# Altium project safety2020.PrjPCB
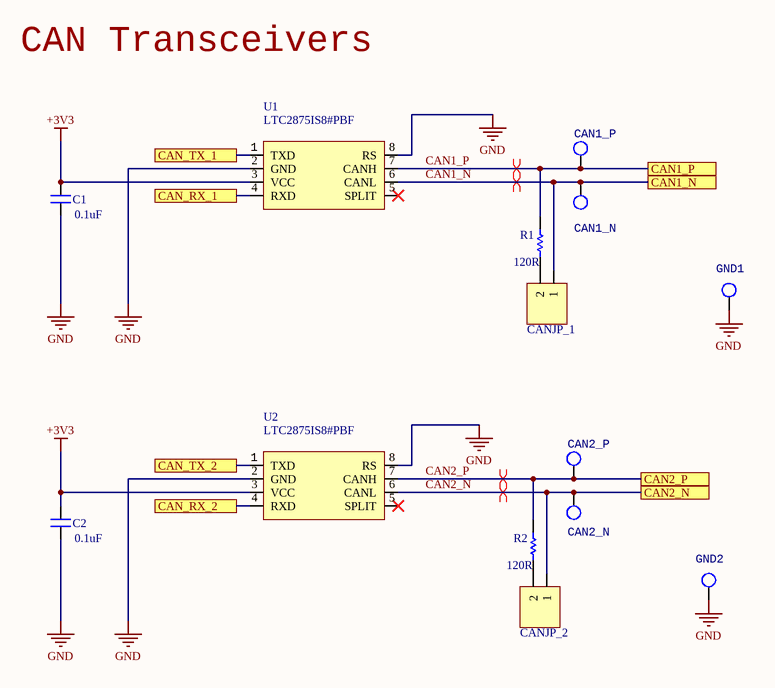
[diagram p0: CAN.SchDoc]
Address1: 200 University Avenue; Address2: Waterloo; Address3: Ontario; Address4: Canada N2L 3G6; BoardName: Your Board Name; DrawnBy: Your Name
7 sheets, 103 parts. Net scope: flat (ports and power ports of the same name join across sheets).
Board file: Safety-Rev1.PcbDoc
Sheets:
  CAN.SchDoc
  Connectors.SchDoc
  MCU.SchDoc
  POWER.SchDoc
  Support.SchDoc
  Sense.SchDoc
  Block Diagram.SchDoc

## Sheet CAN.SchDoc: CAN
size Letter; DrawnBy: Qinyang Bao, Nicole Rosario; Organization: UW Robotics; Address1: 200 University Avenue; Address2: Waterloo; Address3: Ontario; Address4: Canada N2L 3G6

### Parts
C1  value 0.1uF  [CAPC0603(1608)55_N]  (hidden comment: CAP_0.1uF_16V_0603)
C2  value 0.1uF  [CAPC0603(1608)55_N]  (hidden comment: CAP_0.1uF_16V_0603)
CAN1_N  TESTPOINT_LOOP  [TESTPOINT_LOOP]  (value not drawn)
CAN1_P  TESTPOINT_LOOP  [TESTPOINT_LOOP]  (value not drawn)
CAN2_N  TESTPOINT_LOOP  [TESTPOINT_LOOP]  (value not drawn)
CAN2_P  TESTPOINT_LOOP  [TESTPOINT_LOOP]  (value not drawn)
CANJP_1  JUMPER_2  [HDR1X2]  (value not drawn)
CANJP_2  JUMPER_2  [HDR1X2]  (value not drawn)
GND1  TESTPOINT_LOOP  [TESTPOINT_LOOP]  (value not drawn)
GND2  TESTPOINT_LOOP  [TESTPOINT_LOOP]  (value not drawn)
R1  value 120R  [RESC0603(1608)_N]  (hidden comment: RES_120R_0603)
R2  value 120R  [RESC0603(1608)_N]  (hidden comment: RES_120R_0603)
U1  MPN: LTC2875IS8#PBF  [LT-S8_N]  (hidden comment: IC TXRX CAN)
U2  MPN: LTC2875IS8#PBF  [LT-S8_N]  (hidden comment: IC TXRX CAN)

### Ports
CAN1_N, CAN1_P, CAN2_N, CAN2_P, CAN_RX_1, CAN_RX_2, CAN_TX_1, CAN_TX_2

### Nets
+3V3: C1.2 C2.2 U1.3(VCC) U2.3(VCC)
GND: C1.1 C2.1 GND1.1 GND2.1 U1.2(GND) U1.8(RS) U2.2(GND) U2.8(RS)
CAN1_N: CAN1_N.1 CANJP_1.1 U1.6(CANL) ; port CAN1_N
CAN1_P: CAN1_P.1 R1.1 U1.7(CANH) ; port CAN1_P
CAN2_N: CAN2_N.1 CANJP_2.1 U2.6(CANL) ; port CAN2_N
CAN2_P: CAN2_P.1 R2.1 U2.7(CANH) ; port CAN2_P
NetCANJP_1_2: CANJP_1.2 R1.2
NetCANJP_2_2: CANJP_2.2 R2.2
NetSTM1_33: U2.4(RXD) ; port CAN_RX_2
NetSTM1_34: U2.1(TXD) ; port CAN_TX_2
NetSTM1_44: U1.4(RXD) ; port CAN_RX_1
NetSTM1_45: U1.1(TXD) ; port CAN_TX_1

Not connected (* = marked no-connect by the designer): U1 5(SPLIT)*; U2 5(SPLIT)*

### Layout directives
differential pair: CAN1_N, CAN1_P, CAN2_N, CAN2_P

### Notes on the sheet
- CAN Transceivers
- Title
- Size:
- Date:
- Letter
- Drawn By:
- Sheet
- of
- File:

### Library data of the parts
C1 C2 = CAP_0.1uF_16V_0603: CAP CER 0.1UF 16V X7R 0603; MPN: CC0603KRX7R7BB104; Manufacturer: Yageo; Dimensions: 0.063" L x 0.031" W (1.60mm x 0.80mm); Package: 0603 (1608 Metric); Temperature Coefficient: X7R; Voltage Rating: 16V; Supplier Part Number 1: 311-1088-1-ND; Supplier 1: Digi-Key
CAN1_N CAN1_P CAN2_N CAN2_P GND1 GND2 = TESTPOINT_LOOP: Loop testpoint through-hole pad; Manufacturer: Keystone Electronics; Manufacturer Part Number 1: 5002; Supplier Part Number 1: 36-5002-ND; Supplier 1: Digi-Key
CANJP_1 CANJP_2 = JUMPER_2: HEADER 2X1; Supplier 1: Digi-Key; Supplier Part Number 1: A26542-ND
R1 R2 = RES_120R_0603: RES SMD 120 OHM 5% 1/10W 0603; Manufacturer: Yageo; MPN: RC0603JR-07120RL; Package: 0603 (1608 Metric); Dimensions: 0.063" L x 0.031" W (1.60mm x 0.80mm); Tolerance: 5%; Supplier Part Number 1: 311-120GRCT-ND; Supplier 1: Digi-Key
U1 U2 = LTC2875: IC TXRX CAN 4MBPS 8SO; Manufacturer: Linear Technologies; Package: 8-SOIC (0.154", 3.90mm Width); ComponentLink1Description: Datasheet; ComponentLink1URL: https://www.analog.com/media/en/technical-documentation/data-sheets/2875f.pdf; Supplier Part Number 1: LTC2875IS8#PBF-ND; Supplier 1: Digi-Key

## Sheet Connectors.SchDoc: Connectors
size Letter; DrawnBy: Qinyang Bao,  Nicole Rosario; Organization: UW Robotics; Address1: 200 University Avenue; Address2: Waterloo; Address3: Ontario; Address4: Canada N2L 3G6
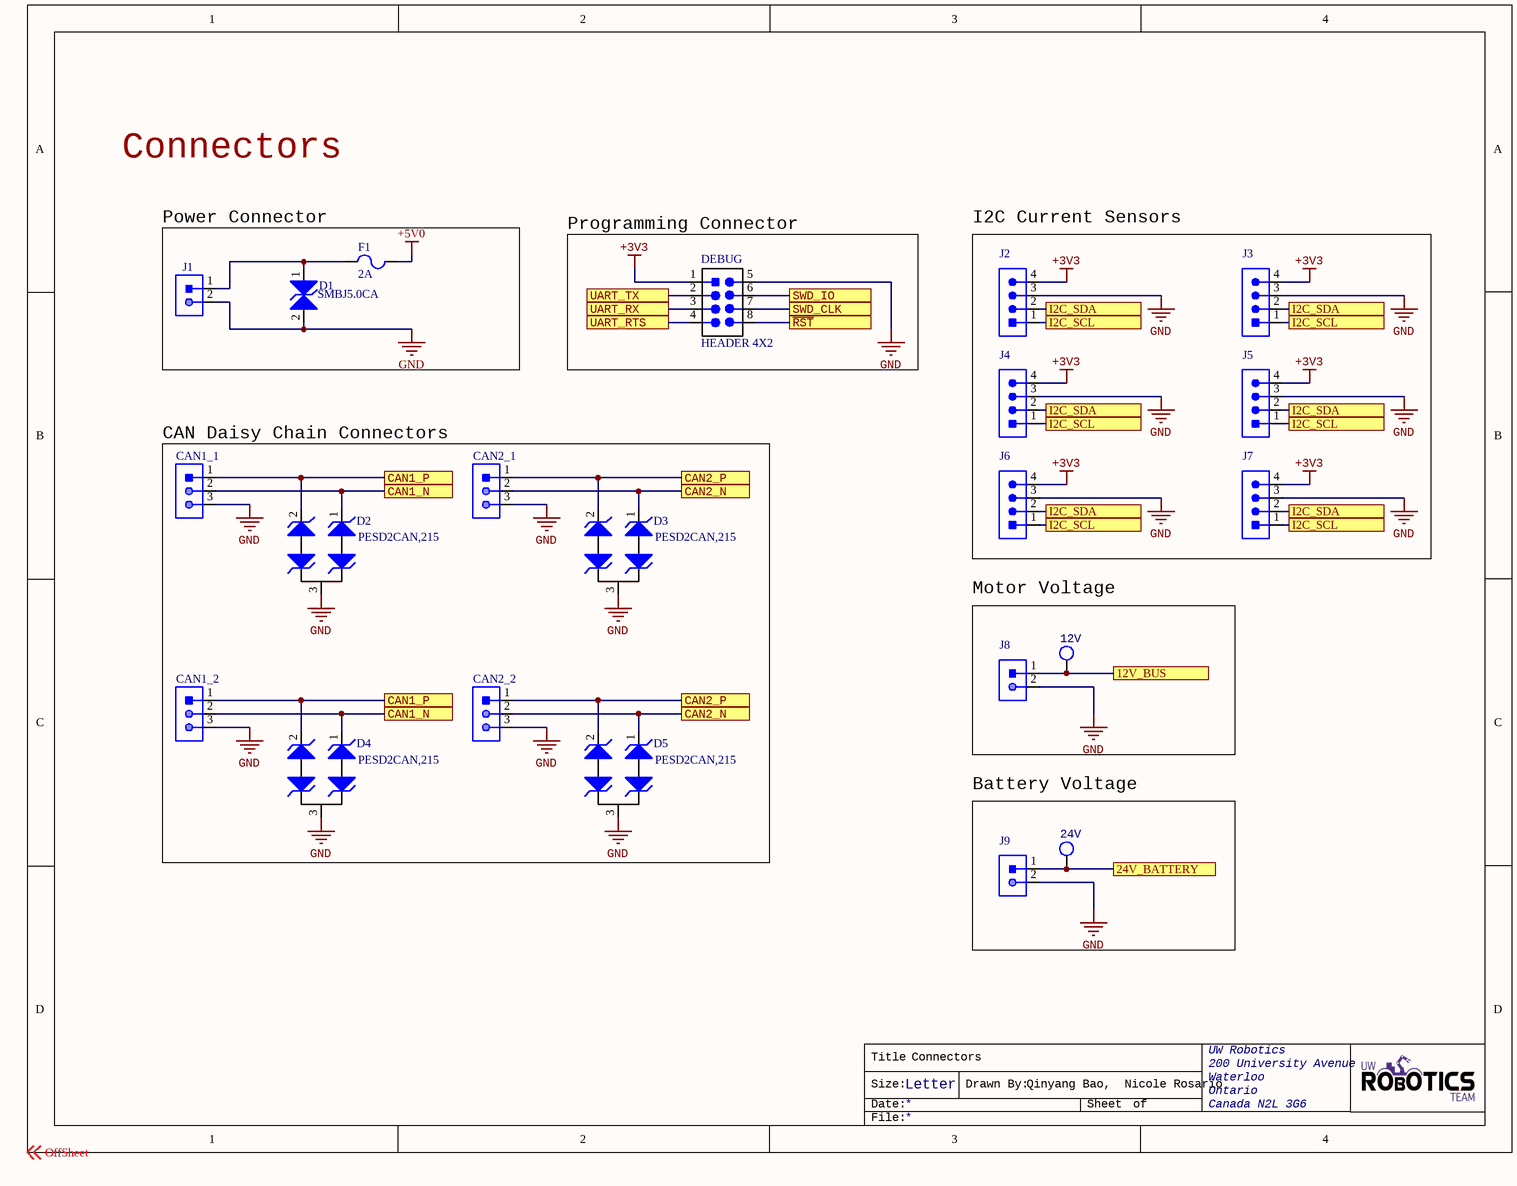
[diagram p1: Connectors.SchDoc]

### Parts
12V  TESTPOINT_LOOP  [TESTPOINT_LOOP]  (value not drawn)
24V  TESTPOINT_LOOP  [TESTPOINT_LOOP]  (value not drawn)
CAN1_1  CON_3M_SM4  [JST-B3B-SM4-TB]  (value not drawn)
CAN1_2  CON_3M_SM4  [JST-B3B-SM4-TB]  (value not drawn)
CAN2_1  CON_3M_SM4  [JST-B3B-SM4-TB]  (value not drawn)
CAN2_2  CON_3M_SM4  [JST-B3B-SM4-TB]  (value not drawn)
D1  Manufacturer Part Number 1: SMBJ5.0CA  [TVS_DIODE_BIDIRECTIONAL]  (hidden comment: TVS_DIODE_BIDIRECTIONAL)
D2  Manufacturer Part Number: PESD2CAN,215  [NXP-SOT323-3]  (hidden comment: TVS_DIODE_CAN)
D3  Manufacturer Part Number: PESD2CAN,215  [NXP-SOT323-3]  (hidden comment: TVS_DIODE_CAN)
D4  Manufacturer Part Number: PESD2CAN,215  [NXP-SOT323-3]  (hidden comment: TVS_DIODE_CAN)
D5  Manufacturer Part Number: PESD2CAN,215  [NXP-SOT323-3]  (hidden comment: TVS_DIODE_CAN)
DEBUG  HEADER 4X2  [HEADER_2X4]
F1  Current Rating: 2A  [FUSE_0603]  (hidden comment: FUSE_2A_0603)
J1  CON_2M_SM4  [JST-B2B-SM4-TB]  (value not drawn)
J2  CON_4M_SM4  [JST-B4B-SM4-TB]  (value not drawn)
J3  CON_4M_SM4  [JST-B4B-SM4-TB]  (value not drawn)
J4  CON_4M_SM4  [JST-B4B-SM4-TB]  (value not drawn)
J5  CON_4M_SM4  [JST-B4B-SM4-TB]  (value not drawn)
J6  CON_4M_SM4  [JST-B4B-SM4-TB]  (value not drawn)
J7  CON_4M_SM4  [JST-B4B-SM4-TB]  (value not drawn)
J8  CON_2M_SM4  [JST-B2B-SM4-TB]  (value not drawn)
J9  CON_2M_SM4  [JST-B2B-SM4-TB]  (value not drawn)

### Blocks framed on the sheet
Power Connector: D1 F1 J1
Programming Connector: DEBUG
I2C Current Sensors: J2-J7
CAN Daisy Chain Connectors: CAN1_1 CAN1_2 CAN2_1 CAN2_2 D2-D5
Motor Voltage: 12V J8
Battery Voltage: 24V J9

### Ports
12V_BUS, 24V_BATTERY, CAN1_N, CAN1_P, CAN2_N, CAN2_P, I2C_SCL, I2C_SDA, SWD_CLK, SWD_IO, UART_RTS, UART_RX, UART_TX, ~{RST}

### Nets
+3V3: DEBUG.1(VCC) J2.4 J3.4 J4.4 J5.4 J6.4 J7.4
+5V0: F1.2
GND: CAN1_1.3 CAN1_2.3 CAN2_1.3 CAN2_2.3 D1.2 D2.3 D3.3 D4.3 D5.3 DEBUG.5(GND) J1.2 J2.3 J3.3 J4.3 J5.3 J6.3 J7.3 J8.2 J9.2
CAN1_N: CAN1_1.2 CAN1_2.2 D2.1 D4.1 ; port CAN1_N
CAN1_P: CAN1_1.1 CAN1_2.1 D2.2 D4.2 ; port CAN1_P
CAN2_N: CAN2_1.2 CAN2_2.2 D3.1 D5.1 ; port CAN2_N
CAN2_P: CAN2_1.1 CAN2_2.1 D3.2 D5.2 ; port CAN2_P
Net12V_1: 12V.1 J8.1 ; port 12V_BUS
Net24V_1: 24V.1 J9.1 ; port 24V_BATTERY
NetC5_2: DEBUG.8 ; port ~{RST}
NetD1_1: D1.1 F1.1 J1.1
NetDEBUG_2: DEBUG.2 ; port UART_TX
NetDEBUG_3: DEBUG.3 ; port UART_RX
NetDEBUG_4: DEBUG.4 ; port UART_RTS
NetDEBUG_6: DEBUG.6 ; port SWD_IO
NetDEBUG_7: DEBUG.7 ; port SWD_CLK
NetJ2_1: J2.1 J3.1 J4.1 J5.1 J6.1 J7.1 ; port I2C_SCL
NetJ2_2: J2.2 J3.2 J4.2 J5.2 J6.2 J7.2 ; port I2C_SDA

### Notes on the sheet
- Connectors
- Labels drawn without touching a wire or pin: OffSheet
- Title
- Size:
- Date:
- Letter
- Drawn By:
- Sheet
- of
- File:

### Library data of the parts
12V 24V = TESTPOINT_LOOP: as CAN1_N on sheet CAN; Supplier Part Number 1: 36-5002-ND; Supplier 1: Digi-Key
CAN1_1 CAN1_2 CAN2_1 CAN2_2 = CON_3M_SM4: Manufacturer: JST; Manufacturer Part Number: B3B-PH-SM4-TB(LF)(SN); Max Current Rating: 2A; Max Voltage Rating: 100V; Pitch: 2mm; Supplier 1: Digi-Key; Supplier Part Number 1: 455-1735-1-ND; ComponentLink1URL: https://datasheet.ciiva.com/11747/0900766b80ddea81-11747684.pdf?src-supplier=RSComponents; ComponentLink1Description: https://datasheet.ciiva.com/11747/0900766b80ddea81-11747684.pdf?src-supplier=RSComponents
D1 = TVS_DIODE_BIDIRECTIONAL: TVS DIODE 5V 9.2V DO214AA; Manufacturer: Nexperia USA Inc.; Manufacturer 1: Littelfuse; Max Surge Current: 65.3A; Reverse Breakdown Voltage: 6.4V; Number of Elements: 1; Peak Pulse Power: 600W; Power Line Protection: No; Max Breakdown Voltage: 7V; Test Current: 10mA; ESD Protection: Yes; Max Reverse Leakage Current: 1.6mA; Max Power Dissipation: 5W; Element Configuration: Single; MPN: SMBJ5.0CA; Package: SC-70, SOT-323; ComponentLink1Description: Datasheet; ComponentLink1URL: https://www.littelfuse.com/~/media/electronics/datasheets/tvs_diodes/littelfuse_tvs_diode_smbj_datasheet.pdf.pdf; Supplier Part Number 1: SMBJ5.0CALFCT-ND; Supplier 1: Digi-Key; Stock 1: 23233; Pricing 1: 1=0.39000, 10=0.31300, 25=0.28640, 100=0.17980, 250=0.17784, 500=0.16650, 1000=0.11322 (USD); Mount: Surface Mount; Case/Package: SMB; Number of Pins: 2; Min Operating Temperature: -65°C; Max Operating Temperature: 150°C; Direction: Bidirectional; Package Quantity: 3000; Packaging: Tape and Reel; Operating Supply Voltage: 5V; Number of Bidirectional Channels: 1; Reverse Standoff Voltage: 5V; Min Breakdown Voltage: 6.4V; Clamping Voltage: 9.2V; Breakdown Voltage: 6.4V; Number of Channels: 1; Polarity: Bidirectional; Termination: SMD/SMT; Power Dissipation: 600W; Peak Pulse Current: 65.3A; Leakage Current: 1.6mA; Voltage Rating (DC): 5V; Composition: Zener; Length: 0.179inch; Height: 0.096inch; Width: 0.155inch; Radiation Hardening: No; REACH SVHC: No SVHC; Lead Free: Lead Free
D2-D5 = TVS_DIODE_CAN: TVS DIODE 24V 41V SOT323-3; Manufacturer: Nexperia USA Inc.; Package: SC-70, SOT-323; ComponentLink1Description: Datasheet; ComponentLink1URL: https://assets.nexperia.com/documents/data-sheet/PESD1CAN-U.pdf; Supplier Part Number 1: 1727-3891-1-ND; Supplier 1: Digi-Key
DEBUG = HEADER 4X2: CONN HEADER VERT 8POS 2.54MM; Manufacturer Part Number 1: M20-9980445; Manufacturer 1: Harwin Inc.; Supplier Part Number 1: 952-2122-ND; Supplier 1: Digi-Key
F1 = FUSE_2A_0603: FUSE SMD 2A 32V; ComponentLink1URL: https://datasheet.ciiva.com/303/467-303400.pdf?src-supplier=Digi-Key; ComponentLink1Description: https://datasheet.ciiva.com/303/467-303400.pdf?src-supplier=Digi-Key; ComponentLink2URL: http://datasheet.octopart.com/0467002.NRHF-Littelfuse-datasheet-32023482.pdf?src-supplier=Future+Electronics; ComponentLink2Description: http://datasheet.octopart.com/0467002.NRHF-Littelfuse-datasheet-32023482.pdf?src-supplier=Future+Electronics; ComponentLink3URL: http://datasheet.octopart.com/0467002.NRHF-Littelfuse-datasheet-136509808.pdf?src-supplier=Future+Electronics; ComponentLink3Description: http://datasheet.octopart.com/0467002.NRHF-Littelfuse-datasheet-136509808.pdf?src-supplier=Future+Electronics; Mount: Surface Mount; Voltage Rating (AC): 32V; Voltage Rating (DC): 32V; Supplier 1: Digi-Key; Supplier Part Number 1: F7132CT-ND; Supplier Packaging 1: Cut Tape
J1 J8 J9 = CON_2M_SM4: Manufacturer: JST; Manufacturer Part Number: B2B-PH-SM4-TB(LF)(SN); Max Current Rating: 2A; Max Voltage Rating: 100V; Pitch: 2mm; Supplier 1: Digi-Key; Supplier Part Number 1: 455-1734-1-ND; ComponentLink1URL: https://datasheet.ciiva.com/11748/0900766b80ddea81-11748001.pdf?src-supplier=RSComponents; ComponentLink1Description: https://datasheet.ciiva.com/11748/0900766b80ddea81-11748001.pdf?src-supplier=RSComponents; ComponentLink2URL: https://datasheet.ciiva.com/16216/b2b-ph-sm4-tblfsn-16216102.pdf?src-supplier=Future+Electronics; ComponentLink2Description: https://datasheet.ciiva.com/16216/b2b-ph-sm4-tblfsn-16216102.pdf?src-supplier=Future+Electronics; ComponentLink3URL: https://datasheet.ciiva.com/8052/80567-8052023.pdf?src-supplier=Element14; ComponentLink3Description: https://datasheet.ciiva.com/8052/80567-8052023.pdf?src-supplier=Element14; ComponentLink4URL: https://datasheet.ciiva.com/712/eph-712504.pdf?src-supplier=Digi-Key; ComponentLink4Description: https://datasheet.ciiva.com/712/eph-712504.pdf?src-supplier=Digi-Key; ComponentLink5URL: https://datasheet.ciiva.com/712/eph-712505.pdf?src-supplier=Digi-Key; ComponentLink5Description: https://datasheet.ciiva.com/712/eph-712505.pdf?src-supplier=Digi-Key; ComponentLink6URL: https://datasheet.ciiva.com/712/eph-712506.pdf?src-supplier=Digi-Key; ComponentLink6Description: https://datasheet.ciiva.com/712/eph-712506.pdf?src-supplier=Digi-Key
J2-J7 = CON_4M_SM4: Manufacturer: JST; Manufacturer Part Number: B4B-PH-SM4-TB(LF)(SN); Max Current Rating: 2A; Max Voltage Rating: 100V; Pitch: 2mm; Supplier 1: Digi-Key; Supplier Part Number 1: 455-1736-1-ND; ComponentLink1URL: https://datasheet.ciiva.com/8052/1699381-8052048.pdf?src-supplier=Element14; ComponentLink1Description: https://datasheet.ciiva.com/8052/1699381-8052048.pdf?src-supplier=Element14; ComponentLink2URL: https://datasheet.ciiva.com/11747/0900766b80ddea81-11747504.pdf?src-supplier=RSComponents; ComponentLink2Description: https://datasheet.ciiva.com/11747/0900766b80ddea81-11747504.pdf?src-supplier=RSComponents; ComponentLink3URL: https://datasheet.ciiva.com/6747/80567-6747409.pdf?src-supplier=Newark; ComponentLink3Description: https://datasheet.ciiva.com/6747/80567-6747409.pdf?src-supplier=Newark; ComponentLink4URL: https://datasheet.ciiva.com/727/eph-727525.pdf?src-supplier=Digi-Key; ComponentLink4Description: https://datasheet.ciiva.com/727/eph-727525.pdf?src-supplier=Digi-Key; ComponentLink5URL: https://datasheet.ciiva.com/712/eph-712582.pdf?src-supplier=Digi-Key; ComponentLink5Description: https://datasheet.ciiva.com/712/eph-712582.pdf?src-supplier=Digi-Key; ComponentLink6URL: https://datasheet.ciiva.com/712/eph-712583.pdf?src-supplier=Digi-Key; ComponentLink6Description: https://datasheet.ciiva.com/712/eph-712583.pdf?src-supplier=Digi-Key

## Sheet MCU.SchDoc: MCU
size Letter; DrawnBy: Qinyang Bao,  Nicole Rosario; Organization: UW Robotics; Address1: 200 University Avenue; Address2: Waterloo; Address3: Ontario; Address4: Canada N2L 3G6
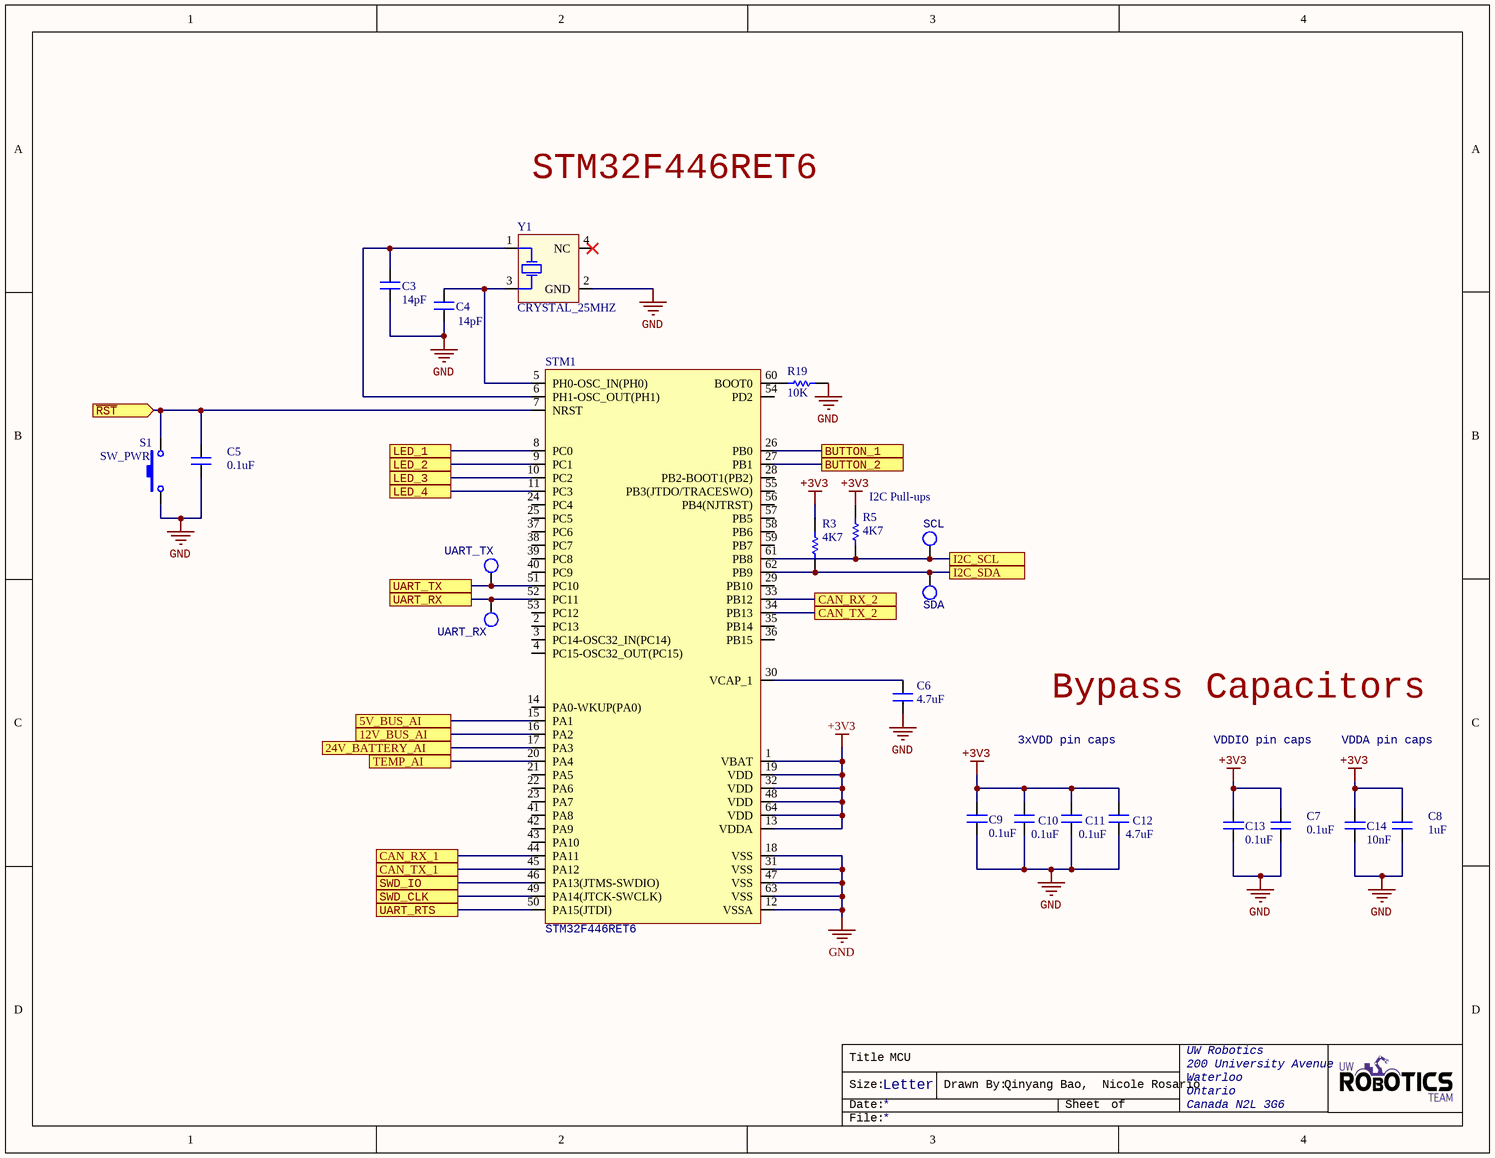
[diagram p2: MCU.SchDoc]

### Parts
C3  value 14pF  [CAPC0603(1608)55_N]  (hidden comment: CL10C140JB8NNNC)
C4  value 14pF  [CAPC0603(1608)55_N]  (hidden comment: CL10C140JB8NNNC)
C5  value 0.1uF  [CAPC0603(1608)55_N]  (hidden comment: CAP_0.1uF_16V_0603)
C6  value 4.7uF  [CAPC0603(1608)55_N]  (hidden comment: CAP_4.7uF_0603)
C7  value 0.1uF  [CAPC0603(1608)55_N]  (hidden comment: CAP_0.1uF_16V_0603)
C8  value 1uF  [CAPC0603(1608)55_N]  (hidden comment: CAP_1uF_16V_0603)
C9  value 0.1uF  [CAPC0603(1608)55_N]  (hidden comment: CAP_0.1uF_16V_0603)
C10  value 0.1uF  [CAPC0603(1608)55_N]  (hidden comment: CAP_0.1uF_16V_0603)
C11  value 0.1uF  [CAPC0603(1608)55_N]  (hidden comment: CAP_0.1uF_16V_0603)
C12  value 4.7uF  [CAPC0603(1608)55_N]  (hidden comment: CAP_4.7uF_0603)
C13  value 0.1uF  [CAPC0603(1608)55_N]  (hidden comment: CAP_0.1uF_16V_0603)
C14  value 10nF  [CAPC0603(1608)55_N]  (hidden comment: CAP_10nF_0603)
R3  value 4K7  [RESC0603(1608)_N]  (hidden comment: RES_4K7_0603)
R5  value 4K7  [RESC0603(1608)_N]  (hidden comment: RES_4K7_0603)
R19  value 10K  [RESC0603(1608)_N]  (hidden comment: RES_10K_0603)
S1  SW_PWR  [PTS830GM140]
SCL  TESTPOINT_LOOP  [TESTPOINT_LOOP]  (value not drawn)
SDA  TESTPOINT_LOOP  [TESTPOINT_LOOP]  (value not drawn)
STM1  STM32F446RET6  [STM-LQFP64_L]
UART_RX  TESTPOINT_LOOP  [TESTPOINT_LOOP]  (value not drawn)
UART_TX  TESTPOINT_LOOP  [TESTPOINT_LOOP]  (value not drawn)
Y1  CRYSTAL_25MHZ  [AVX-CX2520DB32000D0GEJZ1-4_V]

### Ports
5V_BUS_AI, 12V_BUS_AI, 24V_BATTERY_AI, BUTTON_1, BUTTON_2, CAN_RX_1, CAN_RX_2, CAN_TX_1, CAN_TX_2, I2C_SCL, I2C_SDA, LED_1, LED_2, LED_3, LED_4, SWD_CLK, SWD_IO, TEMP_AI, UART_RTS, UART_RX, UART_TX, ~{RST} (in)

### Nets
+3V3: C7.2 C8.2 C9.2 C10.2 C11.2 C12.2 C13.2 C14.2 R3.2 R5.2 STM1.1(VBAT) STM1.13(VDDA) STM1.19(VDD) STM1.32(VDD) STM1.48(VDD) STM1.64(VDD)
GND: C3.1 C4.1 C5.1 C6.1 C7.1 C8.1 C9.1 C10.1 C11.1 C12.1 C13.1 C14.1 R19.1 S1.1 STM1.12(VSSA) STM1.18(VSS) STM1.31(VSS) STM1.47(VSS) STM1.63(VSS) Y1.2(GND)
NetBAT_V_1: STM1.17(PA3) ; port 24V_BATTERY_AI
NetBOARDS_V_1: STM1.15(PA1) ; port 5V_BUS_AI
NetC3_2: C3.2 STM1.6(PH1-OSC_OUT(PH1)) Y1.1(HOT)
NetC4_2: C4.2 STM1.5(PH0-OSC_IN(PH0)) Y1.3(HOT)
NetC5_2: C5.2 S1.2 STM1.7(NRST) ; port ~{RST}
NetC6_2: C6.2 STM1.30(VCAP_1)
NetDEBUG_2: STM1.51(PC10) UART_TX.1 ; port UART_TX
NetDEBUG_3: STM1.52(PC11) UART_RX.1 ; port UART_RX
NetDEBUG_4: STM1.50(PA15(JTDI)) ; port UART_RTS
NetDEBUG_6: STM1.46(PA13(JTMS-SWDIO)) ; port SWD_IO
NetDEBUG_7: STM1.49(PA14(JTCK-SWCLK)) ; port SWD_CLK
NetJ2_1: R5.1 SCL.1 STM1.61(PB8) ; port I2C_SCL
NetJ2_2: R3.1 SDA.1 STM1.62(PB9) ; port I2C_SDA
NetMOTOR_V_1: STM1.16(PA2) ; port 12V_BUS_AI
NetR6_1: STM1.8(PC0) ; port LED_1
NetR7_2: STM1.26(PB0) ; port BUTTON_1
NetR8_1: STM1.9(PC1) ; port LED_2
NetR9_1: STM1.27(PB1) ; port BUTTON_2
NetR10_1: STM1.10(PC2) ; port LED_3
NetR11_1: STM1.11(PC3) ; port LED_4
NetR19_2: R19.2 STM1.60(BOOT0)
NetSTM1_20: STM1.20(PA4) ; port TEMP_AI
NetSTM1_33: STM1.33(PB12) ; port CAN_RX_2
NetSTM1_34: STM1.34(PB13) ; port CAN_TX_2
NetSTM1_44: STM1.44(PA11) ; port CAN_RX_1
NetSTM1_45: STM1.45(PA12) ; port CAN_TX_1

Not connected (* = marked no-connect by the designer): STM1 2(PC13) 3(PC14-OSC32_IN(PC14)) 4(PC15-OSC32_OUT(PC15)) 14(PA0-WKUP(PA0)) 21(PA5) 22(PA6) 23(PA7) 24(PC4) 25(PC5) 28(PB2-BOOT1(PB2)) 29(PB10) 35(PB14) 36(PB15) 37(PC6) 38(PC7) 39(PC8) 40(PC9) 41(PA8) 42(PA9) 43(PA10) 53(PC12) 54(PD2) 55(PB3(JTDO/TRACESWO)) 56(PB4(NJTRST)) 57(PB5) 58(PB6) 59(PB7); Y1 4(NC)*

### Notes on the sheet
- STM32F446RET6
- (near R5) I2C Pull-ups
- Bypass Capacitors
- 3xVDD pin caps
- VDDIO pin caps
- VDDA pin caps
- Title
- Size:
- Date:
- Letter
- Drawn By:
- Sheet
- of
- File:

### Library data of the parts
C3 C4 = CL10C140JB8NNNC: Cap Ceramic 14pF 50V C0G 5% SMD 0603 125C Cardboard T/R; Manufacturer 1: Samsung; Voltage Rating: 50V; Supplier Part Number 1: 1276-2187-1-ND; Supplier 1: Digi-Key; Manufacturer Part Number 1: CL10C140JB8NNNC; Stock 1: 187088; Pricing 1: 1=0.10000, 10=0.06700, 100=0.02980, 500=0.02130, 1000=0.01673 (USD); RoHS: Yes; Mount: Surface Mount; Case/Package: 0603; Case Code (Metric): 1608; Case Code (Imperial): 0603; Min Operating Temperature: -55°C; Max Operating Temperature: 125°C; Tolerance: 5%; Package Quantity: 1; Packaging: Tape and Reel; Voltage Rating (DC): 50V; Dielectric: C0G; Length: 1.6mm; Height: 0.8mm; Width: 0.031inch; Depth: 0.8mm; Thickness: 0.035inch; Radiation Hardening: No; ComponentLink1URL: https://datasheet.ciiva.com/25782/cl10c140jb8nnnc-25782947.pdf?src-supplier=Digi-Key; ComponentLink1Description: https://datasheet.ciiva.com/25782/cl10c140jb8nnnc-25782947.pdf?src-supplier=Digi-Key; Capacitance: 14pF
C5 C7 C9-C11 C13 = CAP_0.1uF_16V_0603: CAP CER 0.1UF 16V X7R 0603; Manufacturer: Yageo; MPN: CC0603KRX7R7BB104; Dimensions: 0.063" L x 0.031" W (1.60mm x 0.80mm); Package: 0603 (1608 Metric); Temperature Coefficient: X7R; Voltage Rating: 16V; Supplier Part Number 1: 311-1088-1-ND; Supplier 1: Digi-Key
C6 C12 = CAP_4.7uF_0603: CAP CER 4.7UF 6.3V X5R 0603; Manufacturer: Yageo; MPN: CC0603KRX5R5BB475; Dimensions: 0.063" L x 0.031" W (1.60mm x 0.80mm); Package: 0603 (1608 Metric); Temperature Coefficient: X5R; Voltage Rating: 6.3V; Supplier Part Number 1: 311-1521-1-ND; Supplier 1: Digi-Key
C8 = CAP_1uF_16V_0603: CAP CER 1UF 16V Y5V 0603; Manufacturer: Yageo; MPN: CC0603ZRY5V7BB105; Dimensions: 0.063" L x 0.031" W (1.60mm x 0.80mm); Package: 0603 (1608 Metric); Temperature Coefficient: Y5V; Voltage Rating: 16V; Supplier Part Number 1: 311-1372-1-ND; Supplier 1: Digi-Key
C14 = CAP_10nF_0603: CAP CER 10000PF 16V X7R 0603; Manufacturer: Yageo; MPN: CC0603KRX7R7BB103; Dimensions: 0.063" L x 0.031" W (1.60mm x 0.80mm); Package: 0603 (1608 Metric); Temperature Coefficient: X7R; Voltage Rating: 16V; Supplier Part Number 1: 311-3369-1-ND; Supplier 1: Digi-Key
R3 R5 = RES_4K7_0603: RES SMD 4.7K OHM 5% 1/10W 0603; Manufacturer: Yageo; MPN: RC0603JR-074K7L; Package: 0603 (1608 Metric); Dimensions: 0.063" L x 0.031" W (1.60mm x 0.80mm); Tolerance: 5%; Supplier Part Number 1: 311-4.7KGRCT-ND; Supplier 1: Digi-Key
R19 = RES_10K_0603: RES SMD 10K OHM 5% 1/10W 0603; Manufacturer: Yageo; MPN: RC0603JR-0710KL; Package: 0603 (1608 Metric); Dimensions: 0.063" L x 0.031" W (1.60mm x 0.80mm); Tolerance: 5%; Supplier Part Number 1: 311-10KGRCT-ND; Supplier 1: Digi-Key
S1 = SW_PWR: Power Switch (Red); pin to pad: 2>4; MPN: PTS830GM140 SMTR LFS; Manufacturer: C&K; ComponentLink1Description: Datasheet; ComponentLink1URL: https://www.ckswitches.com/media/1478/pts830.pdf; Supplier Part Number 1: CKN10587CT-ND; Supplier 1: Digi-Key
SCL SDA UART_RX UART_TX = TESTPOINT_LOOP: as CAN1_N on sheet CAN; Supplier Part Number 1: 36-5002-ND; Supplier 1: Digi-Key
STM1 = MCU_STM32F446RET6: ARM Cortex-M4 32-bit MCU+FPU, 512 KB Flash, 128 KB Internal RAM, 50 I/Os, 64-Pin LQFP, -40 to 85 degC, Tray; I/Os (High Current): 50; Supply Voltage(Vcc) min (V): 1.7; Operating Frequency(F) (Processor speed) (MHz): 180; D/A Converter: 2; Internal RAM Size (kB): 128; FLASH Size (Prog) (kB): 512; Core: ARM Cortex-M4; ComponentLink1Description: Manufacturer URL; Package Reference: 64-Pin Low-profile Quad Flat Package, Body 10 x 10 mm, Pitch 0.5 mm; ComponentLink2URL: http://www.st.com/st-web-ui/static/active/en/resource/technical/document/datasheet/DM00141306.pdf; Packing: Tray; DatasheetVersion: Rev. 6; ComponentLink1URL: http://www.st.com/; ComponentLink2Description: Datasheet; Package Description: LQFP64; Mounting Technology: Surface Mount; Supplier Part Number 1: 497-15376-ND; Supplier 1: Digi-Key
Y1 = CRYSTAL_25MHZ: CRYSTAL 25.0000MHZ 12PF SMD; Manufacturer 1: Kyocera AVX; Manufacturer Part Number 1: CX2520DB25000H0FLJC1; Frequency: 25MHz; ESR (Equivalent Series Resistance): 80R; Frequency Stability: 15ppm; Frequency Tolerance: 10ppm; ComponentLink1Description: https://media.digikey.com/pdf/Data%20Sheets/AVX%20PDFs/CX2520DB_USY1M-H1-16429-00_Spec.pdf?src-supplier=Digi-Key; ComponentLink1URL: https://media.digikey.com/pdf/Data%20Sheets/AVX%20PDFs/CX2520DB_USY1M-H1-16429-00_Spec.pdf?src-supplier=Digi-Key; Supplier 1: Digi-Key; Supplier Part Number 1: 1253-1724-1-ND; Stock 1: 11741; Pricing 1: 1=0.72000, 10=0.63300, 50=0.59120, 100=0.52250, 500=0.49500, 1000=0.41250 (USD); RoHS: Yes; Mount: Surface Mount; Case/Package: SMD/SMT; Min Operating Temperature: -30°C; Max Operating Temperature: 85°C; Packaging: Tape and Reel; Load Capacitance: 12pF; Length: 0.098inch; Height: 0.022inch; Width: 0.079inch; Ratings: AEC-Q200

## Sheet POWER.SchDoc: Power
size Letter; DrawnBy: Qinyang Bao,  Nicole Rosario; Organization: UW Robotics; Address1: 200 University Avenue; Address2: Waterloo; Address3: Ontario; Address4: Canada N2L 3G6
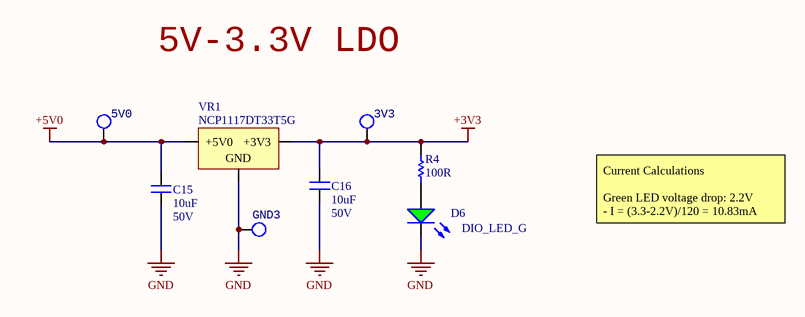
[diagram p3: POWER.SchDoc]

### Parts
3V3  TESTPOINT_LOOP  [TESTPOINT_LOOP]  (value not drawn)
5V0  TESTPOINT_LOOP  [TESTPOINT_LOOP]  (value not drawn)
C15  Voltage Rating: 50V  [CAPC1206(3216)]  (hidden comment: 10uF)
C16  Voltage Rating: 50V  [CAPC1206(3216)]  (hidden comment: 10uF)
D6  DIO_LED_G  [LED_0805_LINE]
GND3  TESTPOINT_LOOP  [TESTPOINT_LOOP]  (value not drawn)
R4  value 100R  [RESC0603(1608)_N]  (hidden comment: RES_100R_0603)
VR1  MPN: NCP1117DT33T5G  [VOLTAGE_REGULATOR]  (hidden comment: 5V0_3V3_LDO)

### Nets
+3V3: 3V3.1 C16.1 R4.2 VR1.2(+3V3)
+5V0: 5V0.1 C15.1 VR1.3(+5V0)
GND: C15.2 C16.2 D6.2(K) GND3.1 VR1.1(GND)
NetD6_1: D6.1(A) R4.1

### Notes on the sheet
- 5V-3.3V LDO
- Current Calculations
  Green LED voltage drop: 2.2V
  - I = (3.3-2.2V)/120 = 10.83mA
- Title
- Size:
- Date:
- Letter
- Drawn By:
- Sheet
- of
- File:

### Library data of the parts
3V3 5V0 GND3 = TESTPOINT_LOOP: as CAN1_N on sheet CAN; Supplier Part Number 1: 36-5002-ND; Supplier 1: Digi-Key
C15 C16 = CAP_10uF_50V_1206: CAP CER 10UF 50V X5R 1206; MPN: GRT31CR61H106KE01L; Manufacturer: Murata; Dimensions: 0.126" L x 0.063" W (3.20mm x 1.6mm); Package: 1206 (3216 Metric); Supplier Part Number 1: 490-12456-1-ND; Supplier 1: Digi-Key; Value: 10uF
D6 = DIO_LED_G: LED GREEN DIFFUSED 0805 SMD; MPN: LG R971-KN-1; Manufacturer: OSRAM; Forward Voltage Drop: 2.2V; Package: 0805 (2012 Metric); Supplier Part Number 1: 475-1410-1-ND; Supplier 1: Digi-Key
R4 = RES_100R_0603: RES SMD 100 OHM 1% 1/10W 0603; Manufacturer: Yageo; MPN: RC0603FR-07100RL; Package: 0603 (1608 Metric); Dimensions: 0.063" L x 0.031" W (1.60mm x 0.80mm); Tolerance: 1%; Supplier Part Number 1: 311-100HRCT-ND; Supplier 1: Digi-Key
VR1 = 5V0_3V3_LDO: IC REG LINEAR 3.3V 1A DPAK; Manufacturer: ON Semiconductor; Current Output: 1A; Supplier Part Number 1: NCP1117DT33T5GOSCT-ND; Supplier 1: Digi-Key

## Sheet Support.SchDoc: Support
size Letter; DrawnBy: Qinyang Bao, Nicole Rosario; Organization: UW Robotics; Address1: 200 University Avenue; Address2: Waterloo; Address3: Ontario; Address4: Canada N2L 3G6
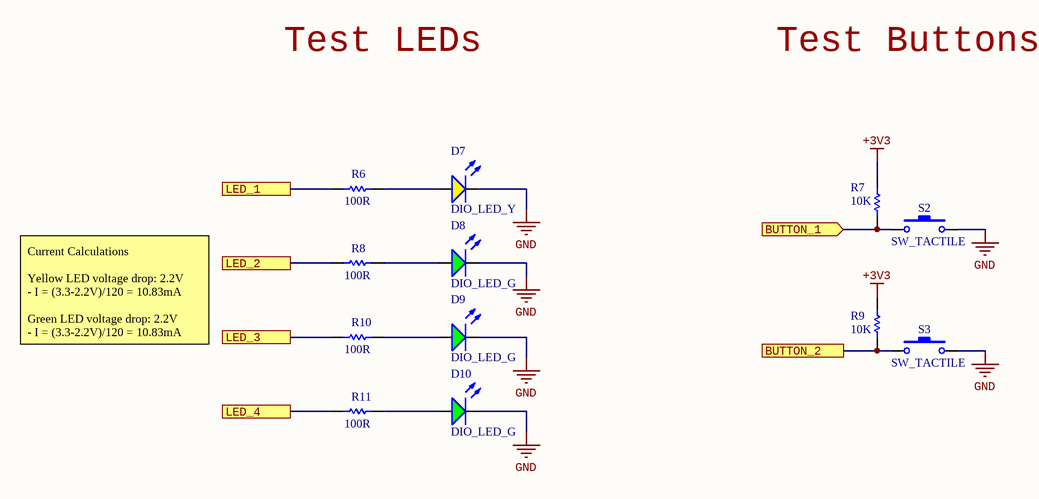
[diagram p4: Support.SchDoc]

### Parts
D7  DIO_LED_Y  [LED_0805_LINE]
D8  DIO_LED_G  [LED_0805_LINE]
D9  DIO_LED_G  [LED_0805_LINE]
D10  DIO_LED_G  [LED_0805_LINE]
R6  value 100R  [RESC0603(1608)_N]  (hidden comment: RES_100R_0603)
R7  value 10K  [RESC0603(1608)_N]  (hidden comment: RES_10K_0603)
R8  value 100R  [RESC0603(1608)_N]  (hidden comment: RES_100R_0603)
R9  value 10K  [RESC0603(1608)_N]  (hidden comment: RES_10K_0603)
R10  value 100R  [RESC0603(1608)_N]  (hidden comment: RES_100R_0603)
R11  value 100R  [RESC0603(1608)_N]  (hidden comment: RES_100R_0603)
S2  SW_TACTILE  [B3U-1100P]
S3  SW_TACTILE  [B3U-1100P]

### Ports
BUTTON_1 (in), BUTTON_2, LED_1, LED_2, LED_3, LED_4

### Nets
+3V3: R7.1 R9.2
GND: D7.2(K) D8.2(K) D9.2(K) D10.2(K) S2.2 S3.2
NetD7_1: D7.1(A) R6.2
NetD8_1: D8.1(A) R8.2
NetD9_1: D9.1(A) R10.2
NetD10_1: D10.1(A) R11.2
NetR6_1: R6.1 ; port LED_1
NetR7_2: R7.2 S2.1 ; port BUTTON_1
NetR8_1: R8.1 ; port LED_2
NetR9_1: R9.1 S3.1 ; port BUTTON_2
NetR10_1: R10.1 ; port LED_3
NetR11_1: R11.1 ; port LED_4

### Notes on the sheet
- Test LEDs
- Test Buttons
- Current Calculations
  Yellow LED voltage drop: 2.2V
  - I = (3.3-2.2V)/120 = 10.83mA
  Green LED voltage drop: 2.2V
  - I = (3.3-2.2V)/120 = 10.83mA
- Title
- Size:
- Date:
- Letter
- Drawn By:
- Sheet
- of
- File:

### Library data of the parts
D7 = DIO_LED_Y: LED YELLOW DIFFUSED 0805 SMD; Manufacturer: OSRAM; MPN: LY R976-PS-36; Forward Voltage Drop: 2.2V; Package: 0805 (2012 Metric); Supplier Part Number 1: 475-2560-1-ND; Supplier 1: Digi-Key
D8-D10 = DIO_LED_G: LED GREEN DIFFUSED 0805 SMD; Manufacturer: OSRAM; MPN: LG R971-KN-1; Forward Voltage Drop: 2.2V; Package: 0805 (2012 Metric); Supplier Part Number 1: 475-1410-1-ND; Supplier 1: Digi-Key
R6 R8 R10 R11 = RES_100R_0603: as R4 on sheet POWER; Package: 0603 (1608 Metric); Dimensions: 0.063" L x 0.031" W (1.60mm x 0.80mm); Tolerance: 1%; Supplier Part Number 1: 311-100HRCT-ND; Supplier 1: Digi-Key
R7 R9 = RES_10K_0603: as R19 on sheet MCU; Package: 0603 (1608 Metric); Dimensions: 0.063" L x 0.031" W (1.60mm x 0.80mm); Tolerance: 5%; Supplier Part Number 1: 311-10KGRCT-ND; Supplier 1: Digi-Key
S2 S3 = SW_TACTILE: Tactile Switch (Grey); Manufacturer: Omron Electronics Inc-EMC Div; MPN: B3U-1100P; Supplier 1: Digi-Key; Supplier Part Number 1: SW1021CT-ND

## Sheet Sense.SchDoc: Sense
size Letter; DrawnBy: Qinyang Bao, Kyle Hong; Organization: UW Robotics; Address1: 200 University Avenue; Address2: Waterloo; Address3: Ontario; Address4: Canada N2L 3G6
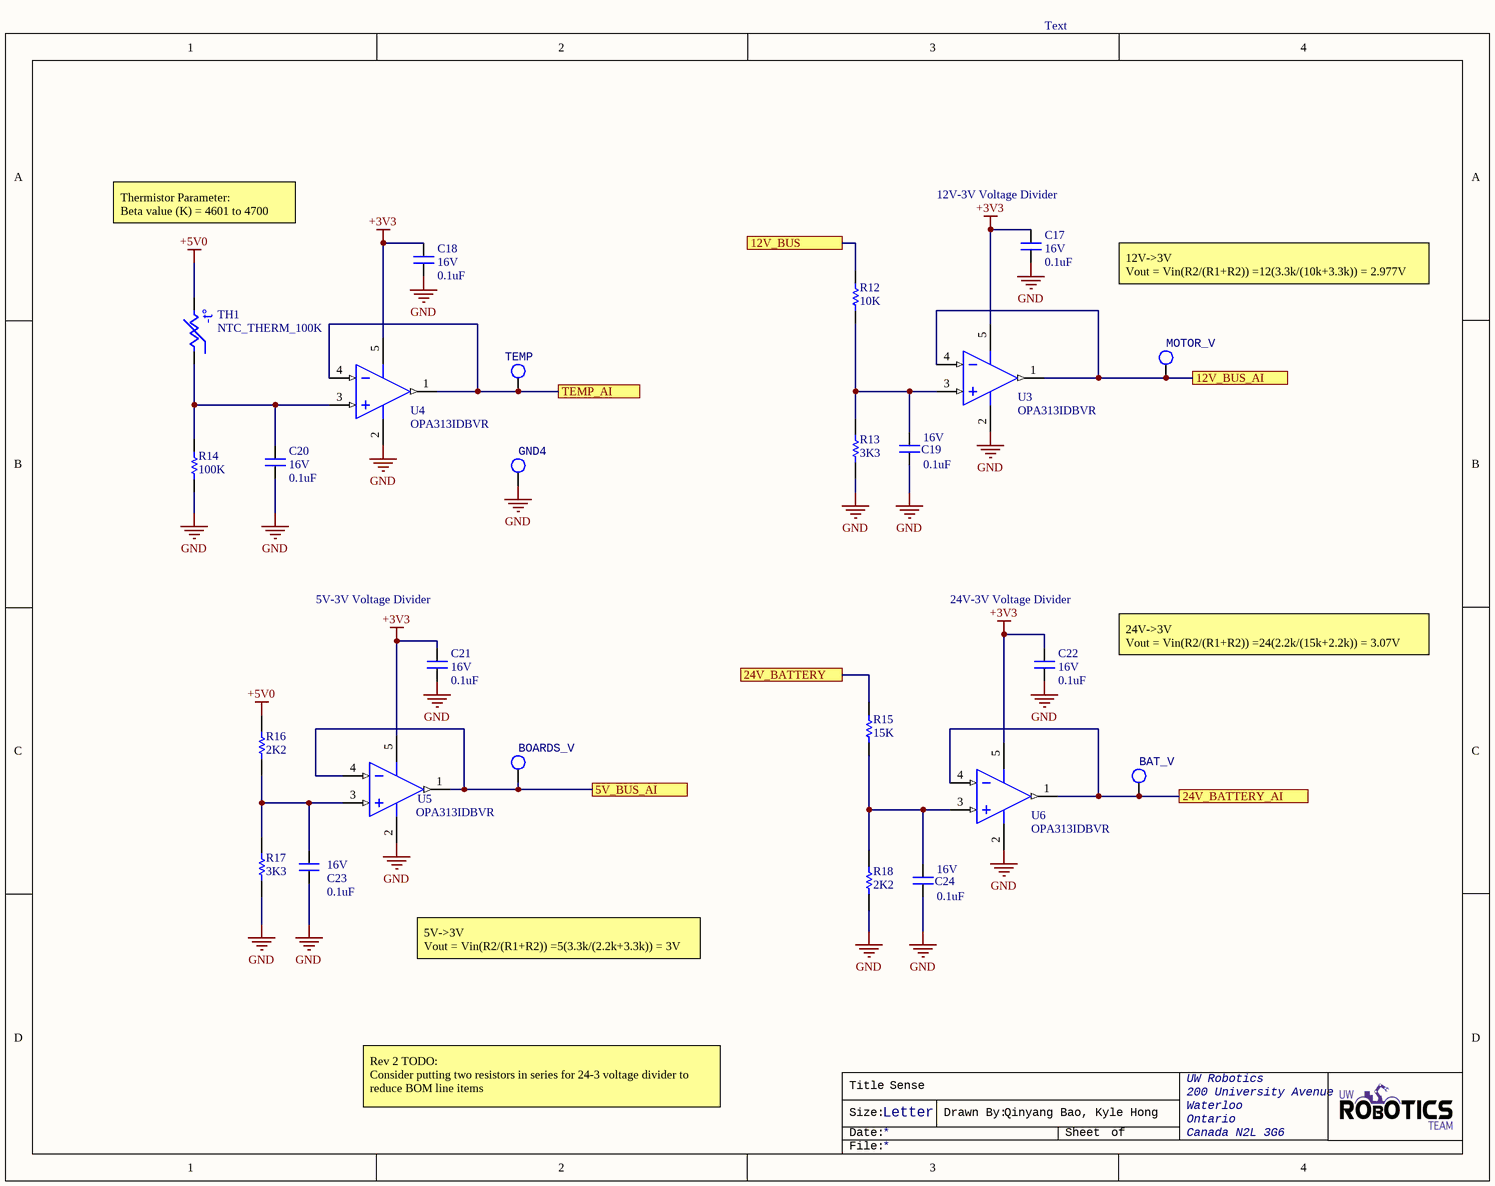
[diagram p5: Sense.SchDoc]

### Parts
BAT_V  TESTPOINT_LOOP  [TESTPOINT_LOOP]  (value not drawn)
BOARDS_V  TESTPOINT_LOOP  [TESTPOINT_LOOP]  (value not drawn)
C17  value 0.1uF  Voltage Rating: 16V  [CAPC0603(1608)55_N]  (hidden comment: CAP_0.1uF_16V_0603)
C18  value 0.1uF  Voltage Rating: 16V  [CAPC0603(1608)55_N]  (hidden comment: CAP_0.1uF_16V_0603)
C19  value 0.1uF  Voltage Rating: 16V  [CAPC0603(1608)55_N]  (hidden comment: CAP_0.1uF_16V_0603)
C20  value 0.1uF  Voltage Rating: 16V  [CAPC0603(1608)55_N]  (hidden comment: CAP_0.1uF_16V_0603)
C21  value 0.1uF  Voltage Rating: 16V  [CAPC0603(1608)55_N]  (hidden comment: CAP_0.1uF_16V_0603)
C22  value 0.1uF  Voltage Rating: 16V  [CAPC0603(1608)55_N]  (hidden comment: CAP_0.1uF_16V_0603)
C23  value 0.1uF  Voltage Rating: 16V  [CAPC0603(1608)55_N]  (hidden comment: CAP_0.1uF_16V_0603)
C24  value 0.1uF  Voltage Rating: 16V  [CAPC0603(1608)55_N]  (hidden comment: CAP_0.1uF_16V_0603)
GND4  TESTPOINT_LOOP  [TESTPOINT_LOOP]  (value not drawn)
MOTOR_V  TESTPOINT_LOOP  [TESTPOINT_LOOP]  (value not drawn)
R12  value 10K  [RESC0603(1608)_N]  (hidden comment: RES_10K_0603)
R13  value 3K3  [RESC0603(1608)_N]  (hidden comment: RES_3K3_0603)
R14  value 100K  [RESC0603(1608)_N]  (hidden comment: RES_100K_0603)
R15  value 15K  [RESC0603(1608)_N]  (hidden comment: RES_15K_0603)
R16  value 2K2  [RESC0603(1608)_N]  (hidden comment: RES_2K2_0603)
R17  value 3K3  [RESC0603(1608)_N]  (hidden comment: RES_3K3_0603)
R18  value 2K2  [RESC0603(1608)_N]  (hidden comment: RES_2K2_0603)
TEMP  TESTPOINT_LOOP  [TESTPOINT_LOOP]  (value not drawn)
TH1  NTC_THERM_100K  [RESC0603(1608)_N]
U3  OPA313IDBVR  [DBV0005A_M]
U4  OPA313IDBVR  [DBV0005A_M]
U5  OPA313IDBVR  [DBV0005A_M]
U6  OPA313IDBVR  [DBV0005A_M]

### Ports
5V_BUS_AI, 12V_BUS, 12V_BUS_AI, 24V_BATTERY, 24V_BATTERY_AI, TEMP_AI

### Nets
+3V3: C17.2 C18.1 C21.2 C22.2 U3.5(V+) U4.5(V+) U5.5(V+) U6.5(V+)
+5V0: R16.2 TH1.1
GND: C17.1 C18.2 C19.1 C20.1 C21.1 C22.1 C23.1 C24.1 GND4.1 R13.1 R14.1 R17.1 R18.1 U3.2(V-) U4.2(V-) U5.2(V-) U6.2(V-)
Net12V_1: R12.2 ; port 12V_BUS
Net24V_1: R15.2 ; port 24V_BATTERY
NetBAT_V_1: BAT_V.1 U6.1(OUT) U6.4(IN-) ; port 24V_BATTERY_AI
NetBOARDS_V_1: BOARDS_V.1 U5.1(OUT) U5.4(IN-) ; port 5V_BUS_AI
NetC19_2: C19.2 R12.1 R13.2 U3.3(IN+)
NetC20_2: C20.2 R14.2 TH1.2 U4.3(IN+)
NetC23_2: C23.2 R16.1 R17.2 U5.3(IN+)
NetC24_2: C24.2 R15.1 R18.2 U6.3(IN+)
NetMOTOR_V_1: MOTOR_V.1 U3.1(OUT) U3.4(IN-) ; port 12V_BUS_AI
NetSTM1_20: TEMP.1 U4.1(OUT) U4.4(IN-) ; port TEMP_AI

### Notes on the sheet
- Text
- Thermistor Parameter:
  Beta value (K) = 4601 to 4700
- (near C17) 12V-3V Voltage Divider
- 12V->3V
  Vout = Vin(R2/(R1+R2)) =12(3.3k/(10k+3.3k)) = 2.977V
- 5V-3V Voltage Divider
- 24V-3V Voltage Divider
- 24V->3V
  Vout = Vin(R2/(R1+R2)) =24(2.2k/(15k+2.2k)) = 3.07V
- 5V->3V
  Vout = Vin(R2/(R1+R2)) =5(3.3k/(2.2k+3.3k)) = 3V
- Rev 2 TODO:
  Consider putting two resistors in series for 24-3 voltage divider to reduce BOM line items
- Title
- Size:
- Date:
- Letter
- Drawn By:
- Sheet
- of
- File:
- (in symbol NTC_THERM_100K) -t°

### Library data of the parts
BAT_V BOARDS_V GND4 MOTOR_V TEMP = TESTPOINT_LOOP: as CAN1_N on sheet CAN; Supplier Part Number 1: 36-5002-ND; Supplier 1: Digi-Key
C17-C24 = CAP_0.1uF_16V_0603: as C1 on sheet CAN; Dimensions: 0.063" L x 0.031" W (1.60mm x 0.80mm); Package: 0603 (1608 Metric); Temperature Coefficient: X7R; Supplier Part Number 1: 311-1088-1-ND; Supplier 1: Digi-Key
R12 = RES_10K_0603: as R19 on sheet MCU; Dimensions: 0.063" L x 0.031" W (1.60mm x 0.80mm); Tolerance: 5%; Package: 0603 (1608 Metric); Supplier Part Number 1: 311-10KGRCT-ND; Supplier 1: Digi-Key
R13 R17 = RES_3K3_0603: RES SMD 3.3K OHM 5% 1/10W 0603; Manufacturer: Yageo; MPN: RC0603JR-073K3L; Dimensions: 0.063" L x 0.031" W (1.60mm x 0.80mm); Tolerance: 5%; Package: 0603 (1608 Metric); Supplier Part Number 1: 311-3.3KGRCT-ND; Supplier 1: Digi-Key; Digikey Part Number: 311-3.3KGRCT-ND
R14 = RES_100K_0603: RES SMD 100K OHM 5% 1/10W 0603; Manufacturer: Yageo; MPN: RC0603FR-07261KL; Dimensions: 0.063" L x 0.031" W (1.60mm x 0.80mm); Tolerance: 5%; Package: 0603 (1608 Metric); Supplier Part Number 1: 311-261KHRCT-ND; Supplier 1: Digi-Key
R15 = RES_15K_0603: RES SMD 15K OHM 5% 1/10W 0603; Manufacturer 1: Yageo; Manufacturer Part Number 1: RC0603JR-0715KL; Dimensions: 0.063" L x 0.031" W (1.60mm x 0.80mm); Tolerance: 5%; Package: 0603 (1608 Metric); Supplier Part Number 1: 311-15KGRCT-ND; Supplier 1: Digi-Key
R16 R18 = RES_2K2_0603: RES SMD 2.2K OHM 1% 1/10W 0603; Manufacturer: Yageo; MPN: RC0603FR-072K2L; Dimensions: 0.063" L x 0.031" W (1.60mm x 0.80mm); Tolerance: 1%; Package: 0603 (1608 Metric); Supplier Part Number 1: 311-2.20KHRCT-ND; Supplier 1: Digi-Key
TH1 = NTC_THERM_100K: THERM NTC 100KOHM 4700K 0603; MPN: ERT-J1VV104J; Manufacturer: Panasonic; Value: 100K; Supplier Part Number 1: P10555CT-ND; Supplier 1: Digi-Key
U3-U6 = OPAMP: IC OPAMP GP 1 CIRCUIT SOT23-5; Manufacturer: Texas Instruments; Offset Drift(Typ)(uV/C): 2; Rating: Catalog; Packing: LARGE T&R; SubFamily: Low Input Bias Current Amp (<=10pA), Low Power Amp (<=500uA); Number of Channels: 1; Eco-Plan: Green (RoHS & no Sb/Br); Vio (25C)(Max)(mV): 2.5; Total Supply Voltage(Min)(+5V is 5, +/-5V is 10): 1.8; CMRR(Min)(dB): 70; Total Supply Voltage(Max)(+5V is 5, +/-5V is 10): 5.5; Iq per channel(Max)(mA): 0.06; Slew Rate(Typ)(V/us): 0.5; ComponentLink1Description: Manufacturer URL; PackageVersion: 4073253-4/K, 03/2006; ComponentLink2Description: Datasheet; Code_JEDEC: MO-178; GBW(Typ)(MHz): 1; ComponentLink3Description: Package Specification; PartNumber: OPA313IDBVR; PackageReference: DBV0005A; Mounting Technology: Surface Mount; PackageDescription: 5-Pin Plastic Small Outline, Body 1.6 x 2.9 mm, Pitch 0.95 mm; ComponentLink1URL: http://www.ti.com/; DatasheetVersion: SBOS649C; ComponentLink2URL: http://www.ti.com/lit/ds/symlink/opa313.pdf; ComponentLink3URL: http://www.ti.com/litv/pdf/mpds018i; Supplier Part Number 1: 296-35607-1-ND; Supplier 1: Digi-Key

## Sheet Block Diagram.SchDoc: Safety - Block Diagram
size Letter; DrawnBy: Qinyang Bao; Organization: UW Robotics; Address1: 200 University Avenue; Address2: Waterloo; Address3: Ontario; Address4: Canada N2L 3G6
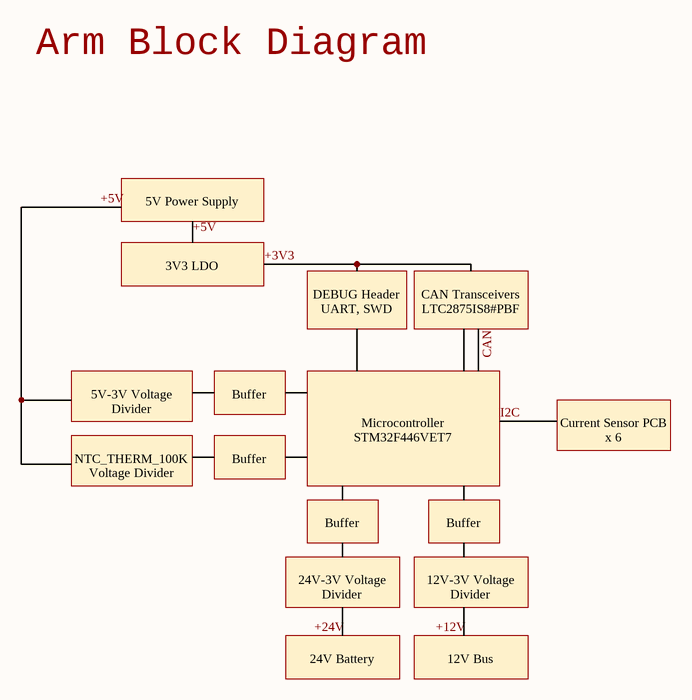
[diagram p6: Block Diagram.SchDoc]

### Notes on the sheet
- Arm Block Diagram
- 5V Power Supply
- 3V3 LDO
- DEBUG Header
  UART, SWD
- CAN Transceivers
  LTC2875IS8#PBF
- 5V-3V Voltage Divider
- Buffer
- Current Sensor PCB x 6
- NTC_THERM_100K Voltage Divider
- Microcontroller
  STM32F446VET7
- 24V-3V Voltage Divider
- 12V-3V Voltage Divider
- 24V Battery
- 12V Bus
- Labels drawn without touching a wire or pin: +12V, +24V
- Title
- Size:
- Date:
- Letter
- Drawn By:
- Sheet
- of
- File:

## Nets that join several sheets
+3V3: CAN (C1.2 C2.2 U1.3 U2.3), Connectors (7 pins), MCU (16 pins), POWER (3V3.1 C16.1 R4.2 VR1.2), Support (R7.1 R9.2), Sense (8 pins)
+5V0: Connectors (F1.2), POWER (5V0.1 C15.1 VR1.3), Sense (R16.2 TH1.1)
GND: CAN (8 pins), Connectors (19 pins), MCU (20 pins), POWER (5 pins), Support (6 pins), Sense (17 pins)
CAN1_N: CAN (CAN1_N.1 CANJP_1.1 U1.6), Connectors (CAN1_1.2 CAN1_2.2 D2.1 D4.1)
CAN1_P: CAN (CAN1_P.1 R1.1 U1.7), Connectors (CAN1_1.1 CAN1_2.1 D2.2 D4.2)
CAN2_N: CAN (CAN2_N.1 CANJP_2.1 U2.6), Connectors (CAN2_1.2 CAN2_2.2 D3.1 D5.1)
CAN2_P: CAN (CAN2_P.1 R2.1 U2.7), Connectors (CAN2_1.1 CAN2_2.1 D3.2 D5.2)
Net12V_1: Connectors (12V.1 J8.1), Sense (R12.2)
Net24V_1: Connectors (24V.1 J9.1), Sense (R15.2)
NetBAT_V_1: MCU (STM1.17), Sense (BAT_V.1 U6.1 U6.4)
NetBOARDS_V_1: MCU (STM1.15), Sense (BOARDS_V.1 U5.1 U5.4)
NetC5_2: Connectors (DEBUG.8), MCU (C5.2 S1.2 STM1.7)
NetDEBUG_2: Connectors (DEBUG.2), MCU (STM1.51 UART_TX.1)
NetDEBUG_3: Connectors (DEBUG.3), MCU (STM1.52 UART_RX.1)
NetDEBUG_4: Connectors (DEBUG.4), MCU (STM1.50)
NetDEBUG_6: Connectors (DEBUG.6), MCU (STM1.46)
NetDEBUG_7: Connectors (DEBUG.7), MCU (STM1.49)
NetJ2_1: Connectors (6 pins), MCU (R5.1 SCL.1 STM1.61)
NetJ2_2: Connectors (6 pins), MCU (R3.1 SDA.1 STM1.62)
NetMOTOR_V_1: MCU (STM1.16), Sense (MOTOR_V.1 U3.1 U3.4)
NetR6_1: MCU (STM1.8), Support (R6.1)
NetR7_2: MCU (STM1.26), Support (R7.2 S2.1)
NetR8_1: MCU (STM1.9), Support (R8.1)
NetR9_1: MCU (STM1.27), Support (R9.1 S3.1)
NetR10_1: MCU (STM1.10), Support (R10.1)
NetR11_1: MCU (STM1.11), Support (R11.1)
NetSTM1_20: MCU (STM1.20), Sense (TEMP.1 U4.1 U4.4)
NetSTM1_33: CAN (U2.4), MCU (STM1.33)
NetSTM1_34: CAN (U2.1), MCU (STM1.34)
NetSTM1_44: CAN (U1.4), MCU (STM1.44)
NetSTM1_45: CAN (U1.1), MCU (STM1.45)